# Altium project MB1312.PrjPCB
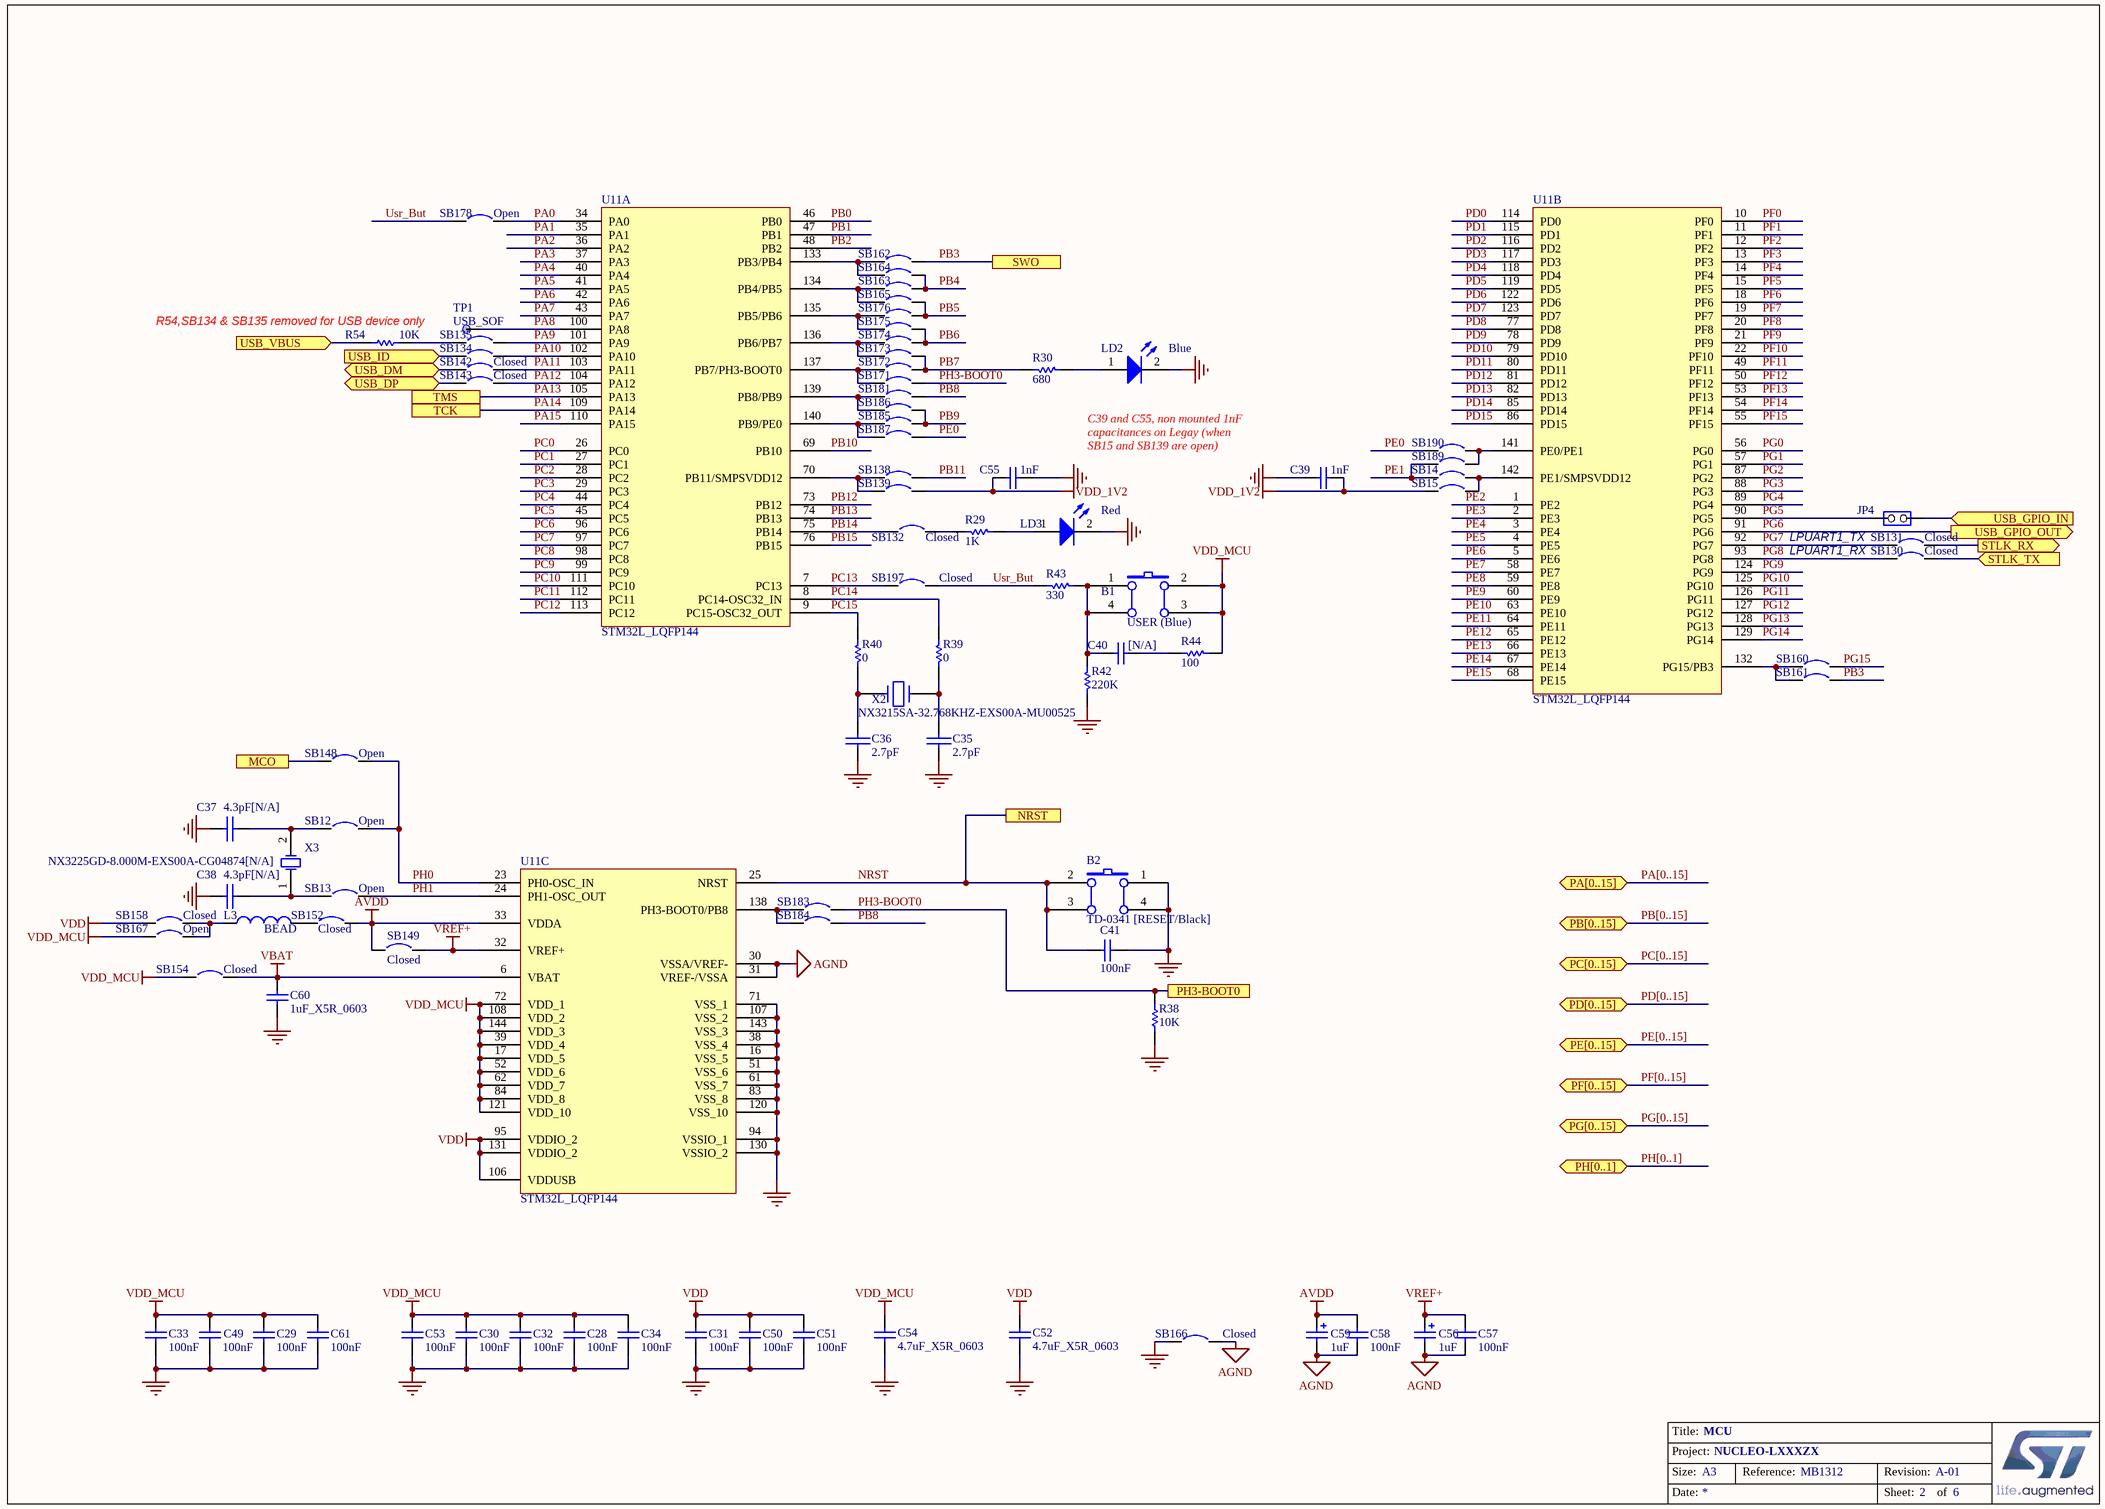
[diagram p0: STM32L_144.SchDoc]
2 sheets, 137 parts. Net scope: flat (ports and power ports of the same name join across sheets).
Board file: MB1312.PcbDoc
Sheets:
  STM32L_144.SchDoc
  Connectors.SchDoc

## Sheet STM32L_144.SchDoc: MCU
size A3; DocumentNumber: MB1312; Revision: A-01; SheetNumber: 2; SheetTotal: 6; Project: NUCLEO-LXXXZX

### Parts
B1  USER (Blue)  [PB-6X6mm-Blue]
B2  TD-0341 [RESET/Black]  [PB-6X6mm-Black]
C28  100nF  [0603C]
C29  100nF  [0603C]
C30  100nF  [0603C]
C31  100nF  [0603C]
C32  100nF  [0603C]
C33  100nF  [0603C]
C34  100nF  [0603C]
C35  2.7pF  [0603C]
C36  2.7pF  [0603C]
C37  4.3pF[N/A]  [0603C]
C38  4.3pF[N/A]  [0603C]
C39  1nF  [0603C]
C40  [N/A]  [0603C]
C41  100nF  [0603C]
C49  100nF  [0603C]
C50  100nF  [0603C]
C51  100nF  [0603C]
C52  4.7uF_X5R_0603  [0603C]
C53  100nF  [0603C]
C54  4.7uF_X5R_0603  [0603C]
C55  1nF  [0603C]
C56  value 1uF  [TAN-A]  (hidden comment: TAJA105K016R)
C57  100nF  [0603C]
C58  100nF  [0603C]
C59  value 1uF  [TAN-A]  (hidden comment: TAJA105K016R)
C60  1uF_X5R_0603  [0603C]
C61  100nF  [0603C]
JP4  (no value)  [HDR_1x2_2R54_V_M_S]
L3  BEAD  [0603L]
LD2  Blue  [0603D-B]
LD3  Red  [0603D-R]
R29  1K  [0603R]
R30  680  [0603R]
R38  10K  [0603R]
R39  0  [0603R]
R40  0  [0603R]
R42  220K  [0603R]
R43  330  [0603R]
R44  100  [0603R]
R54  10K  [0603R]
SB12  Open  [SB_0603]
SB13  Open  [SB_0603]
SB14  Circuit Breaker  [SB_0603]  (value not drawn)
SB15  Circuit Breaker  [SB_0603]  (value not drawn)
SB130  Closed  [SB_0603]
SB131  Closed  [SB_0603]
SB132  Closed  [SB_0603]
SB134  Circuit Breaker  [SB_0603]  (value not drawn)
SB135  Circuit Breaker  [SB_0603]  (value not drawn)
SB138  Circuit Breaker  [SB_0603]  (value not drawn)
SB139  Circuit Breaker  [SB_0603]  (value not drawn)
SB142  Closed  [SB_0603]
SB143  Closed  [SB_0603]
SB148  Open  [SB_0603]
SB149  Closed  [SB_0603]
SB152  Closed  [SB_0603]
SB154  Closed  [SB_0603]
SB158  Closed  [SB_0603]
SB160  Circuit Breaker  [SB_0603]  (value not drawn)
SB161  Circuit Breaker  [SB_0603]  (value not drawn)
SB162  Circuit Breaker  [SB_0603]  (value not drawn)
SB163  Circuit Breaker  [SB_0603]  (value not drawn)
SB164  Circuit Breaker  [SB_0603]  (value not drawn)
SB165  Circuit Breaker  [SB_0603]  (value not drawn)
SB166  Closed  [SB_0603]
SB167  Open  [SB_0603]
SB171  Circuit Breaker  [SB_0603]  (value not drawn)
SB172  Circuit Breaker  [SB_0603]  (value not drawn)
SB173  Circuit Breaker  [SB_0603]  (value not drawn)
SB174  Circuit Breaker  [SB_0603]  (value not drawn)
SB175  Circuit Breaker  [SB_0603]  (value not drawn)
SB176  Circuit Breaker  [SB_0603]  (value not drawn)
SB178  Open  [SB_0603]
SB181  Circuit Breaker  [SB_0603]  (value not drawn)
SB183  Circuit Breaker  [SB_0603]  (value not drawn)
SB184  Circuit Breaker  [SB_0603]  (value not drawn)
SB185  Circuit Breaker  [SB_0603]  (value not drawn)
SB186  Circuit Breaker  [SB_0603]  (value not drawn)
SB187  Circuit Breaker  [SB_0603]  (value not drawn)
SB189  Circuit Breaker  [SB_0603]  (value not drawn)
SB190  Circuit Breaker  [SB_0603]  (value not drawn)
SB197  Closed  [SB_0603]
TP1  USB_SOF  [TP]
U11  STM32L_LQFP144  [LQFP144_0R5_SKT]  (parts A,B,C of 3)
X2  NX3215SA-32.768KHZ-EXS00A-MU00525  [XTAL_2SM_3R2X1R5]
X3  NX3225GD-8.000M-EXS00A-CG04874[N/A]  [OSC_2SM_3R2x2R5]

### Ports
MCO, NRST, PA[0..15] (bidir), PB[0..15] (bidir), PC[0..15] (bidir), PD[0..15] (bidir), PE[0..15] (bidir), PF[0..15] (bidir), PG[0..15] (bidir), PH3-BOOT0, PH[0..1] (bidir), STLK_RX (out), STLK_TX (in), SWO, TCK, TMS, USB_DM (bidir), USB_DP (bidir), USB_GPIO_IN (in), USB_GPIO_OUT (out), USB_ID (in), USB_VBUS (in)

### Nets
AGND: C56.2 C57.2 C58.2 C59.2 SB166.2 U11.30(VSSA/VREF-) U11.31(VREF-/VSSA)
AVDD: C58.1 C59.1 SB149.1 SB152.2 U11.33(VDDA)
GND: B2.1(A0) B2.4(A1) C28.2 C29.2 C30.2 C31.2 C32.2 C33.2 C34.2 C35.2 C36.2 C37.2 C38.2 C39.1 C41.1 C49.2 C50.2 C51.2 C52.2 C53.2 C54.2 C55.1 C60.2 C61.2 LD2.2(K) LD3.2(K) R38.2 R42.2 SB166.1 U11.16(VSS_5) U11.38(VSS_4) U11.51(VSS_6) U11.61(VSS_7) U11.71(VSS_1) U11.83(VSS_8) U11.94(VSSIO_1) U11.107(VSS_2) U11.120(VSS_10) U11.130(VSSIO_2) U11.143(VSS_3)
VBAT: C60.1 SB154.2 U11.6(VBAT)
VDD: C31.1 C50.1 C51.1 C52.1 SB158.1 U11.95(VDDIO_2) U11.106(VDDUSB) U11.131(VDDIO_2)
VDD_1V2: C39.2 C55.2 SB15.2 SB139.2
VDD_MCU: B1.2(B0) B1.3(B1) C28.1 C29.1 C30.1 C32.1 C33.1 C34.1 C49.1 C53.1 C54.1 C61.1 R44.1 SB154.1 SB167.1 U11.17(VDD_5) U11.39(VDD_4) U11.52(VDD_6) U11.62(VDD_7) U11.72(VDD_1) U11.84(VDD_8) U11.108(VDD_2) U11.121(VDD_10) U11.144(VDD_3)
VREF+: C56.1 C57.1 SB149.2 U11.32(VREF+)
NRST: B2.2(B0) B2.3(B1) C41.2 U11.25(NRST) ; port NRST
PA0: SB178.2 U11.34(PA0)
PA1: U11.35(PA1)
PA2: U11.36(PA2)
PA3: U11.37(PA3)
PA4: U11.40(PA4)
PA5: U11.41(PA5)
PA6: U11.42(PA6)
PA7: U11.43(PA7)
PA8: TP1.1 U11.100(PA8)
PA9: SB135.2 U11.101(PA9)
PA10: SB134.2 U11.102(PA10)
PA11: SB142.2 U11.103(PA11)
PA12: SB143.2 U11.104(PA12)
PA13: U11.105(PA13) ; port TMS
PA14: U11.109(PA14) ; port TCK
PA15: U11.110(PA15)
PB0: U11.46(PB0)
PB1: U11.47(PB1)
PB2: U11.48(PB2)
PB3: SB161.2 SB162.2 ; port SWO
PB4: SB163.2 SB164.2
PB5: SB165.2 SB176.2
PB6: SB174.2 SB175.2
PB7: R30.1 SB172.2 SB173.2
PB8: SB181.2 SB184.2
PB9: SB185.2 SB186.2
PB10: U11.69(PB10)
PB11: SB138.2
PB12: U11.73(PB12)
PB13: U11.74(PB13)
PB14: SB132.1 U11.75(PB14)
PB15: U11.76(PB15)
PC0: U11.26(PC0)
PC1: U11.27(PC1)
PC2: U11.28(PC2)
PC3: U11.29(PC3)
PC4: U11.44(PC4)
PC5: U11.45(PC5)
PC6: U11.96(PC6)
PC7: U11.97(PC7)
PC8: U11.98(PC8)
PC9: U11.99(PC9)
PC10: U11.111(PC10)
PC11: U11.112(PC11)
PC12: U11.113(PC12)
PC13: SB197.1 U11.7(PC13)
PC14: R39.2 U11.8(PC14-OSC32_IN)
PC15: R40.2 U11.9(PC15-OSC32_OUT)
PD0: U11.114(PD0)
PD1: U11.115(PD1)
PD2: U11.116(PD2)
PD3: U11.117(PD3)
PD4: U11.118(PD4)
PD5: U11.119(PD5)
PD6: U11.122(PD6)
PD7: U11.123(PD7)
PD8: U11.77(PD8)
PD9: U11.78(PD9)
PD10: U11.79(PD10)
PD11: U11.80(PD11)
PD12: U11.81(PD12)
PD13: U11.82(PD13)
PD14: U11.85(PD14)
PD15: U11.86(PD15)
PE0: SB187.2 SB190.1
PE1: SB14.1 SB189.1
PE2: U11.1(PE2)
PE3: U11.2(PE3)
PE4: U11.3(PE4)
PE5: U11.4(PE5)
PE6: U11.5(PE6)
PE7: U11.58(PE7)
PE8: U11.59(PE8)
PE9: U11.60(PE9)
PE10: U11.63(PE10)
PE11: U11.64(PE11)
PE12: U11.65(PE12)
PE13: U11.66(PE13)
PE14: U11.67(PE14)
PE15: U11.68(PE15)
PF0: U11.10(PF0)
PF1: U11.11(PF1)
PF2: U11.12(PF2)
PF3: U11.13(PF3)
PF4: U11.14(PF4)
PF5: U11.15(PF5)
PF6: U11.18(PF6)
PF7: U11.19(PF7)
PF8: U11.20(PF8)
PF9: U11.21(PF9)
PF10: U11.22(PF10)
PF11: U11.49(PF11)
PF12: U11.50(PF12)
PF13: U11.53(PF13)
PF14: U11.54(PF14)
PF15: U11.55(PF15)
PG0: U11.56(PG0)
PG1: U11.57(PG1)
PG2: U11.87(PG2)
PG3: U11.88(PG3)
PG4: U11.89(PG4)
PG5: JP4.2(NO) U11.90(PG5)
PG6: U11.91(PG6) ; port USB_GPIO_OUT
PG7: SB131.1 U11.92(PG7)
PG8: SB130.1 U11.93(PG8)
PG9: U11.124(PG9)
PG10: U11.125(PG10)
PG11: U11.126(PG11)
PG12: U11.127(PG12)
PG13: U11.128(PG13)
PG14: U11.129(PG14)
PG15: SB160.2
PH0: SB12.2 SB148.1 U11.23(PH0-OSC_IN)
PH1: SB13.2 U11.24(PH1-OSC_OUT)
PH3-BOOT0: R38.1 SB171.2 SB183.2 ; port PH3-BOOT0
Usr_But: R43.2 SB178.1 SB197.2
NetB1_1: B1.1(A0) B1.4(A1) C40.2 R42.1 R43.1
NetC35_1: C35.1 R39.1 X2.2
NetC36_1: C36.1 R40.1 X2.1
NetC37_1: C37.1 SB12.1 X3.2(OSC2)
NetC38_1: C38.1 SB13.1 X3.1(OSC1)
NetC40_1: C40.1 R44.2
NetJP4_1: JP4.1(COMMON) ; port USB_GPIO_IN
NetL3_1: L3.1 SB158.2 SB167.2
NetL3_2: L3.2 SB152.1
NetLD2_1: LD2.1(A) R30.2
NetLD3_1: LD3.1(A) R29.2
NetR29_1: R29.1 SB132.2
NetR54_1: R54.1 ; port USB_VBUS
NetR54_2: R54.2 SB135.1
NetSB14_2: SB14.2 SB15.1 U11.142(PE1/SMPSVDD12)
NetSB130_2: SB130.2 ; port STLK_TX
NetSB131_2: SB131.2 ; port STLK_RX
NetSB134_1: SB134.1 ; port USB_ID
NetSB138_1: SB138.1 SB139.1 U11.70(PB11/SMPSVDD12)
NetSB142_1: SB142.1 ; port USB_DM
NetSB143_1: SB143.1 ; port USB_DP
NetSB148_2: SB148.2 ; port MCO
NetSB160_1: SB160.1 SB161.1 U11.132(PG15/PB3)
NetSB162_1: SB162.1 SB164.1 U11.133(PB3/PB4)
NetSB163_1: SB163.1 SB165.1 U11.134(PB4/PB5)
NetSB171_1: SB171.1 SB172.1 U11.137(PB7/PH3-BOOT0)
NetSB173_1: SB173.1 SB174.1 U11.136(PB6/PB7)
NetSB175_1: SB175.1 SB176.1 U11.135(PB5/PB6)
NetSB181_1: SB181.1 SB186.1 U11.139(PB8/PB9)
NetSB183_1: SB183.1 SB184.1 U11.138(PH3-BOOT0/PB8)
NetSB185_1: SB185.1 SB187.1 U11.140(PB9/PE0)
NetSB189_2: SB189.2 SB190.2 U11.141(PE0/PE1)

### Buses and harness runs
bus PA[0..15] = port PA[0..15]
bus PB[0..15] = port PB[0..15]
bus PC[0..15] = port PC[0..15]
bus PD[0..15] = port PD[0..15]
bus PE[0..15] = port PE[0..15]
bus PF[0..15] = port PF[0..15]
bus PG[0..15] = port PG[0..15]
bus PH[0..1] = port PH[0..1]

### Notes on the sheet
- (near R54) R54,SB134 & SB135 removed for USB device only
- C39 and C55, non mounted 1nF capacitances on Legay (when SB15 and SB139 are open)
- LPUART1_TX
- LPUART1_RX
- Title:
- Project:
- Size:
- Date:
- A3
- Reference:
- Sheet:
- Revision:
- of

### Library data of the parts
B1 B2 = SW PUSHBUTTON: SE PUSHBUTTON
C28-C34 C39 C49-C51 C53 C55 C57 C58 C61 = Cap: Capacitor; Value: 10nF; Published: 8-Jun-2000; Revision: July-2002: Re-released for DXP Platform.; Publisher: Altium Limited
C35-C38 = CAP: Capacitor
C40 C41 = CAP: Capacitor; Value: 100pF; Published: 8-Jun-2000; Revision: July-2002: Re-released for DXP Platform.; Publisher: Altium Limited
C52 C54 = CAP SMD 0603  X5R 1µF 25V 10%: 0603  X5R 4.7uF; Value: 1µF; Rated voltage: 25V; Tolerance: 10%; Manufacturer: *; Manufacturer P/N: *; Order code Farnell: 1288202RL; Power: *; Technology: X5R; Temperature  Factor: *; Temperature Max: +125°C; Temperature Min: -55°C; STS Code: *
C56 C59 = Cap Pol1: Tan Capacitor,1uF,10%,16V,Tan-A,TAJA105K016R; Manuf_1: AVX; Ordered by: Subcon; ECCN_US/EU: NA; Published: 8-Jun-2000; Revision: July-2002: Re-released for DXP Platform.; Publisher: Altium Limited; Manuf_Part_1: TAJA105K016R
C60 = CAP SMD 0603  X5R 1µF 25V 10%: 0603  X5R 1µF; Rated voltage: 25V; Tolerance: 10%; Manufacturer: *; Manufacturer P/N: *; Order code Farnell: 1288202RL; Value: 1µF; Power: *; Technology: X5R; Temperature  Factor: *; Temperature Max: +125°C; Temperature Min: -55°C; STS Code: *
JP4 = JP2
L3 = Inductor: Value: 100uH; Published: 8-Jun-2000; Revision: July-2002: Re-released for DXP Platform.; Publisher: Altium Limited
LD2 LD3 = LED2: Typical RED, GREEN, YELLOW, AMBER GaAs LED; Published: 8-Jun-2000; Revision: July-2002: Re-released for DXP Platform.; Publisher: Altium Limited
R29 = Res1: Resistor; Published: 8-Jun-2000; Revision: July-2002: Re-released for DXP Platform.; Publisher: Altium Limited; Value: 1K
R30 R39 R40 R43 R44 = Res1: Resistor; Value: 1K; Published: 8-Jun-2000; Revision: July-2002: Re-released for DXP Platform.; Publisher: Altium Limited
R38 R42 = res1: Resistor; Value: 1K; Published: 8-Jun-2000; Revision: July-2002: Re-released for DXP Platform.; Publisher: Altium Limited
R54 = Resistor_ST: Resistor 0402 / 0603 / 0805; Value: 10K
SB12 SB13 SB148 SB167 SB178 = Circuit Breaker: Published: 24-Mar-1999; Revision: July-2002: Re-released for DXP Platform.; Publisher: Altium Limited
SB14 SB15 SB134 SB135 SB138 SB139 SB160-SB165 SB171-SB176 SB181 SB183-SB187 SB189 SB190 = Circuit Breaker: Solder: NO; Published: 24-Mar-1999; Revision: July-2002: Re-released for DXP Platform.; Publisher: Altium Limited
SB130-SB132 SB142 SB143 SB149 SB152 SB154 SB158 SB166 SB197 = Circuit Breaker_close: Circuit Breaker; Published: 24-Mar-1999; Revision: July-2002: Re-released for DXP Platform.; Publisher: Altium Limited
TP1 = TP
X2 = CRYSTAL_32K: Crystal
X3 = XTAL: Crystal Oscillator; Published: 8-Jun-2000; LatestRevisionDate: 17-Jul-2002; LatestRevisionNote: Re-released for DXP Platform.; PackageReference: R38; Publisher: Altium Limited

## Sheet Connectors.SchDoc: Extension connectors
size A3; DocumentNumber: MB1312; Revision: A-01; SheetNumber: 5; SheetTotal: 6; Project: NUCLEO-LXXXZX
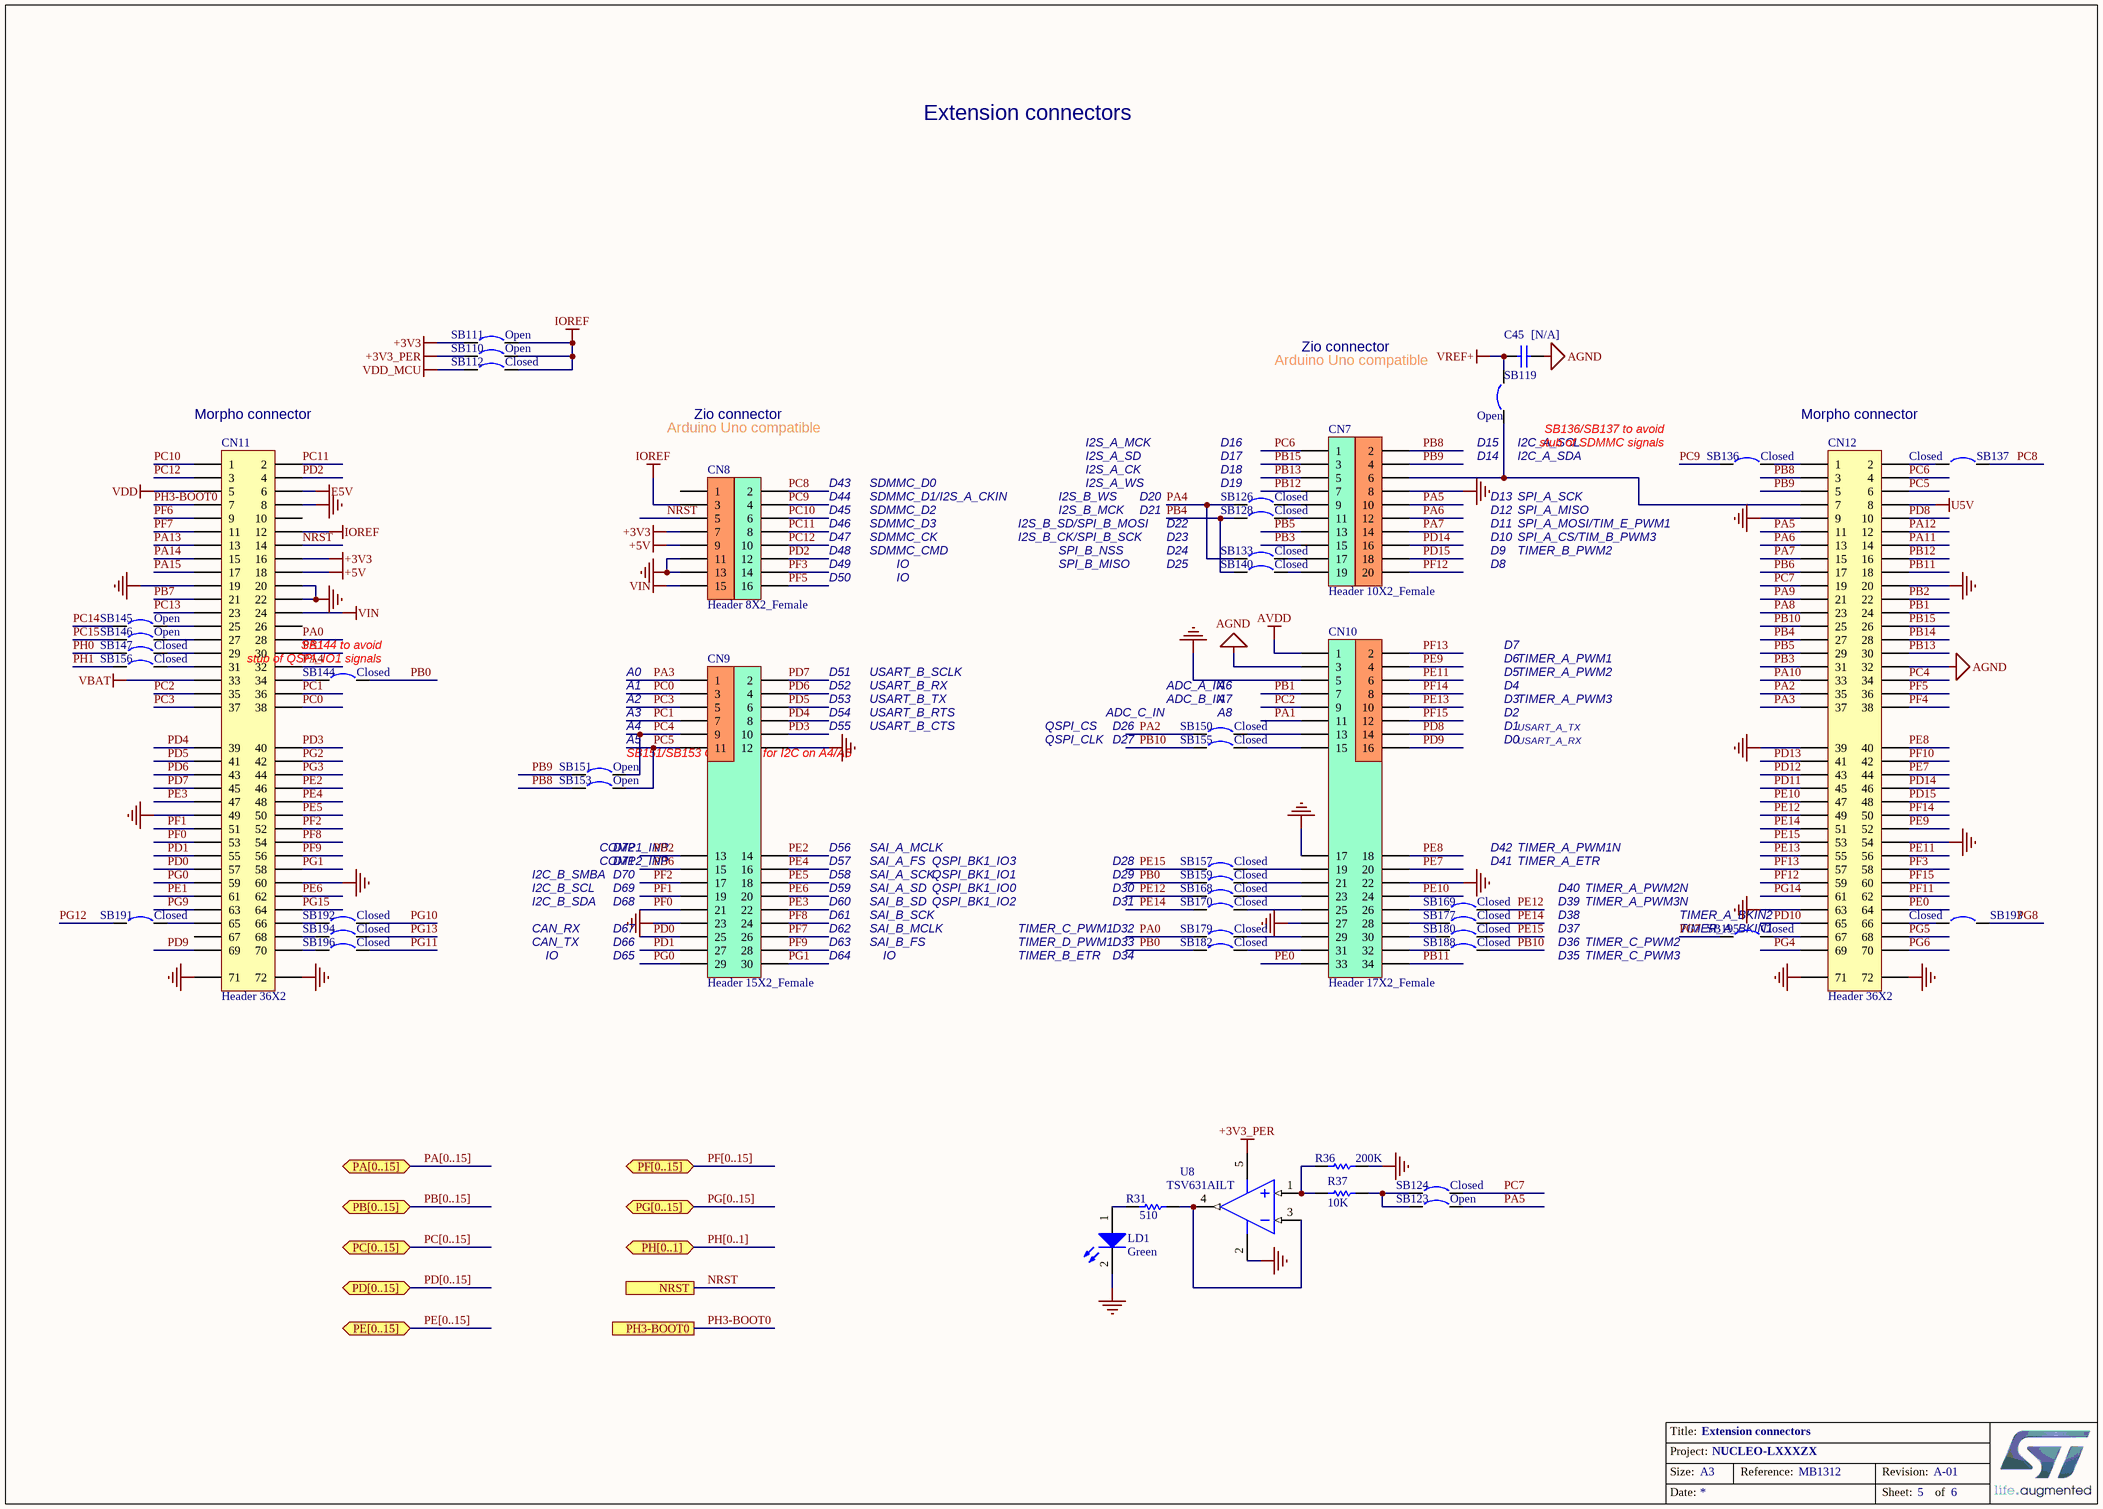
[diagram p1: Connectors.SchDoc]

### Parts
C45  [N/A]  [0603C]
CN7  Header 10X2_Female  [HDR_10x2_2R54_V_F]
CN8  Header 8X2_Female  [HDR_8x2_2R54_V_F]
CN9  Header 15X2_Female  [HDR_15x2_2R54_V_F]
CN10  Header 17X2_Female  [HDR_17x2_2R54_V_F]
CN11  Header 36X2  [HDR_2x36_2R54_V_M]
CN12  Header 36X2  [HDR_2x36_2R54_V_M]
LD1  Green  [0603D-G]
R31  510  [0603R]
R36  200K  [0603R]
R37  10K  [0603R]
SB110  Open  [SB_0603]
SB111  Open  [SB_0603]
SB112  Closed  [SB_0603]
SB119  Open  [SB_0603]
SB123  Open  [SB_0603]
SB124  Closed  [SB_0603]
SB126  Closed  [SB_0603]
SB128  Closed  [SB_0603]
SB133  Closed  [SB_0603]
SB136  Closed  [SB_0603]
SB137  Closed  [SB_0603]
SB140  Closed  [SB_0603]
SB144  Closed  [SB_0603]
SB145  Open  [SB_0603]
SB146  Open  [SB_0603]
SB147  Closed  [SB_0603]
SB150  Closed  [SB_0603]
SB151  Open  [SB_0603]
SB153  Open  [SB_0603]
SB155  Closed  [SB_0603]
SB156  Closed  [SB_0603]
SB157  Closed  [SB_0603]
SB159  Closed  [SB_0603]
SB168  Closed  [SB_0603]
SB169  Closed  [SB_0603]
SB170  Closed  [SB_0603]
SB177  Closed  [SB_0603]
SB179  Closed  [SB_0603]
SB180  Closed  [SB_0603]
SB182  Closed  [SB_0603]
SB188  Closed  [SB_0603]
SB191  Closed  [SB_0603]
SB192  Closed  [SB_0603]
SB193  Closed  [SB_0603]
SB194  Closed  [SB_0603]
SB195  Closed  [SB_0603]
SB196  Closed  [SB_0603]
U8  TSV631AILT  [SOT-23-5L]

### Ports
NRST, PA[0..15] (bidir), PB[0..15] (bidir), PC[0..15] (bidir), PD[0..15] (bidir), PE[0..15] (bidir), PF[0..15] (bidir), PG[0..15] (bidir), PH3-BOOT0, PH[0..1] (bidir)

### Nets
+3V3: CN8.7 CN11.16 SB111.1
+3V3_PER: SB110.1 U8.5(VCC)
+5V: CN8.9 CN11.18
AGND: C45.2 CN10.3 CN12.32
AVDD: CN10.1
E5V: CN11.6
GND: CN7.8 CN8.11 CN8.13 CN9.12 CN9.23 CN10.5 CN10.17 CN10.22 CN10.27 CN11.8 CN11.19 CN11.20 CN11.22 CN11.49 CN11.60 CN11.71 CN11.72 CN12.9 CN12.20 CN12.39 CN12.54 CN12.63 CN12.71 CN12.72 LD1.2(K) R36.2 U8.2(VDD)
IOREF: CN8.3 CN11.12 SB110.2 SB111.2 SB112.2
U5V: CN12.8
VBAT: CN11.33
VDD: CN11.5
VDD_MCU: SB112.1
VIN: CN8.15 CN11.24
VREF+: C45.1 SB119.1
NRST: CN8.5 CN11.14 ; port NRST
PA0: CN11.28 SB179.1
PA1: CN10.11 CN11.30
PA2: CN12.35 SB150.1
PA3: CN9.1 CN12.37
PA4: CN11.32 SB126.1 SB133.1
PA5: CN7.10 CN12.11 SB123.2
PA6: CN7.12 CN12.13
PA7: CN7.14 CN12.15
PA8: CN12.23
PA9: CN12.21
PA10: CN12.33
PA11: CN12.14
PA12: CN12.12
PA13: CN11.13
PA14: CN11.15
PA15: CN11.17
PB0: SB144.2 SB159.1 SB182.1
PB1: CN10.7 CN12.24
PB2: CN9.13 CN12.22
PB3: CN7.15 CN12.31
PB4: CN12.27 SB128.1 SB140.1
PB5: CN7.13 CN12.29
PB6: CN9.15 CN12.17
PB7: CN11.21
PB8: CN7.2 CN12.3 SB153.2
PB9: CN7.4 CN12.5 SB151.2
PB10: CN12.25 SB155.1 SB188.2
PB11: CN10.34 CN12.18
PB12: CN7.7 CN12.16
PB13: CN7.5 CN12.30
PB14: CN12.28
PB15: CN7.3 CN12.26
PC0: CN9.3 CN11.38
PC1: CN9.7 CN11.36
PC2: CN10.9 CN11.35
PC3: CN9.5 CN11.37
PC4: CN9.9 CN12.34 SB151.1
PC5: CN9.11 CN12.6 SB153.1
PC6: CN7.1 CN12.4
PC7: CN12.19 SB124.1
PC8: CN8.2 SB137.1
PC9: CN8.4 SB136.1
PC10: CN8.6 CN11.1
PC11: CN8.8 CN11.2
PC12: CN8.10 CN11.3
PC13: CN11.23
PC14: SB145.1
PC15: SB146.1
PD0: CN9.25 CN11.57
PD1: CN9.27 CN11.55
PD2: CN8.12 CN11.4
PD3: CN9.10 CN11.40
PD4: CN9.8 CN11.39
PD5: CN9.6 CN11.41
PD6: CN9.4 CN11.43
PD7: CN9.2 CN11.45
PD8: CN10.14 CN12.10
PD9: CN10.16 CN11.69
PD10: CN12.65
PD11: CN12.45
PD12: CN12.43
PD13: CN12.41
PD14: CN7.16 CN12.46
PD15: CN7.18 CN12.48
PE0: CN10.33 CN12.64
PE1: CN11.61
PE2: CN9.14 CN11.46
PE3: CN9.22 CN11.47
PE4: CN9.16 CN11.48
PE5: CN9.18 CN11.50
PE6: CN9.20 CN11.62
PE7: CN10.20 CN12.44
PE8: CN10.18 CN12.40
PE9: CN10.4 CN12.52
PE10: CN10.24 CN12.47
PE11: CN10.6 CN12.56
PE12: CN12.49 SB168.1 SB169.2
PE13: CN10.10 CN12.55
PE14: CN12.51 SB170.1 SB177.2
PE15: CN12.53 SB157.1 SB180.2
PF0: CN9.21 CN11.53
PF1: CN9.19 CN11.51
PF2: CN9.17 CN11.52
PF3: CN8.14 CN12.58
PF4: CN12.38
PF5: CN8.16 CN12.36
PF6: CN11.9
PF7: CN9.26 CN11.11
PF8: CN9.24 CN11.54
PF9: CN9.28 CN11.56
PF10: CN12.42
PF11: CN12.62
PF12: CN7.20 CN12.59
PF13: CN10.2 CN12.57
PF14: CN10.8 CN12.50
PF15: CN10.12 CN12.60
PG0: CN9.29 CN11.59
PG1: CN9.30 CN11.58
PG2: CN11.42
PG3: CN11.44
PG4: CN12.69
PG5: CN12.68
PG6: CN12.70
PG7: SB195.1
PG8: SB193.2
PG9: CN11.63
PG10: SB192.2
PG11: SB196.2
PG12: SB191.1
PG13: SB194.2
PG14: CN12.61
PG15: CN11.64
PH0: SB147.1
PH1: SB156.1
PH3-BOOT0: CN11.7 ; port PH3-BOOT0
NetCN7_6: CN7.6 CN12.7 SB119.2
NetCN7_9: CN7.9 SB126.2
NetCN7_11: CN7.11 SB128.2
NetCN7_17: CN7.17 SB133.2
NetCN7_19: CN7.19 SB140.2
NetCN10_13: CN10.13 SB150.2
NetCN10_15: CN10.15 SB155.2
NetCN10_19: CN10.19 SB157.2
NetCN10_21: CN10.21 SB159.2
NetCN10_23: CN10.23 SB168.2
NetCN10_25: CN10.25 SB170.2
NetCN10_26: CN10.26 SB169.1
NetCN10_28: CN10.28 SB177.1
NetCN10_29: CN10.29 SB179.2
NetCN10_30: CN10.30 SB180.1
NetCN10_31: CN10.31 SB182.2
NetCN10_32: CN10.32 SB188.1
NetCN11_25: CN11.25 SB145.2
NetCN11_27: CN11.27 SB146.2
NetCN11_29: CN11.29 SB147.2
NetCN11_31: CN11.31 SB156.2
NetCN11_34: CN11.34 SB144.1
NetCN11_65: CN11.65 SB191.2
NetCN11_66: CN11.66 SB192.1
NetCN11_68: CN11.68 SB194.1
NetCN11_70: CN11.70 SB196.1
NetCN12_1: CN12.1 SB136.2
NetCN12_2: CN12.2 SB137.2
NetCN12_66: CN12.66 SB193.1
NetCN12_67: CN12.67 SB195.2
NetLD1_1: LD1.1(A) R31.2
NetR31_1: R31.1 U8.3(IN-) U8.4(OUT)
NetR36_1: R36.1 R37.1 U8.1(IN+)
NetR37_2: R37.2 SB123.1 SB124.2

Not connected (* = marked no-connect by the designer): CN8 1; CN11 10 26 67

### Buses and harness runs
bus PA[0..15] = port PA[0..15]
bus PB[0..15] = port PB[0..15]
bus PC[0..15] = port PC[0..15]
bus PD[0..15] = port PD[0..15]
bus PE[0..15] = port PE[0..15]
bus PF[0..15] = port PF[0..15]
bus PG[0..15] = port PG[0..15]
bus PH[0..1] = port PH[0..1]

### Notes on the sheet
- Extension connectors
- Arduino Uno compatible
- Zio connector
- (near CN11) Morpho connector
- I2S_A_MCK
- D16
- (near SB119) D15
- (near SB119) I2C_A_SCL
- (near SB136) SB136/SB137 to avoid
- (near SB136) stub of SDMMC signals
- Morpho connector
- D43
- D44
- D45
- SDMMC_D0
- SDMMC_D1/I2S_A_CKIN
- SDMMC_D2
- I2S_B_WS
- I2S_B_MCK
- I2S_A_SD
- I2S_A_CK
- I2S_A_WS
- D20
- D21
- D17
- D18
- (near SB126) D19
- (near SB119) D14
- D13
- D12
- SPI_A_SCK
- SPI_A_MISO
- (near SB119) I2C_A_SDA
- D46
- D47
- D48
- D49
- D50
- SDMMC_CK
- SDMMC_CMD
- SDMMC_D3
- IO
- I2S_B_SD/SPI_B_MOSI
- I2S_B_CK/SPI_B_SCK
- SPI_B_MISO
- SPI_B_NSS
- D22
- D23
- D24
- D25
- D8
- D9
- D10
- D11
- TIMER_B_PWM2
- SPI_A_CS/TIM_B_PWM3
- SPI_A_MOSI/TIM_E_PWM1
- (near SB144) SB144 to avoid
- D7
- (near SB144) stub of QSPI_IO1 signals
- A0
- A1
- A2
- A3
- D51
- D52
- D53
- D54
- USART_B_TX
- USART_B_RX
- USART_B_SCLK
- USART_B_RTS
- ADC_A_IN
- ADC_B_IN
- (near SB150) ADC_C_IN
- A6
- A7
- (near SB150) A8
- D2
- D4
- D3
- D5
- D6
- TIMER_A_PWM1
- TIMER_A_PWM2
- TIMER_A_PWM3
- A4
- A5
- (near SB151) SB151/SB153 Close only for I2C on A4/A5
- D55
- USART_B_CTS
- QSPI_CLK
- QSPI_CS
- D26
- D27
- D0
- D1
- USART_A_TX
- USART_A_RX
- COMP1_INP
- D72
- D56
- SAI_A_MCLK
- D42
- TIMER_A_PWM1N
- I2C_B_SCL
- I2C_B_SDA
- I2C_B_SMBA
- COMP2_INP
- D71
- D70
- D69
- D68
- D57
- D58
- D59
- D60
- D61
- SAI_A_SD
- SAI_A_SCK
- SAI_A_FS
- SAI_B_SD
- SAI_B_SCK
- QSPI_BK1_IO0
- QSPI_BK1_IO2
- QSPI_BK1_IO1
- QSPI_BK1_IO3
- D28
- D29
- D30
- D31
- D41
- TIMER_A_ETR
- D38
- D39
- D40
- TIMER_A_PWM2N
- TIMER_A_PWM3N
- TIMER_A_BKIN2
- CAN_TX
- CAN_RX
- D67
- D66
- D65
- D62
- D63
- D64
- SAI_B_FS
- SAI_B_MCLK
- TIMER_D_PWM1
- TIMER_B_ETR
- TIMER_C_PWM1
- D32
- D33
- D34
- D35
- D36
- D37
- TIMER_C_PWM2
- TIMER_C_PWM3
- TIMER_A_BKIN1
- Title:
- Project:
- Size:
- Date:
- Reference:
- Sheet:
- Revision:
- of

### Library data of the parts
C45 = Cap: Capacitor,100nF,10%,16V,X7R,0603,YAGEO; Manuf_Part_1: CC0603KRX7R7BB104; Ordered by: Subcon; Published: 8-Jun-2000; Revision: July-2002: Re-released for DXP Platform.; Publisher: Altium Limited; Value: 100nF; Manuf_1: YAGEO
CN7 = Header 10X2_Female: Header, 10-Pin, Dual row,female; LatestRevisionDate: 17-Jul-2002; LatestRevisionNote: Re-released for DXP Platform.; Publisher: Altium Limited
CN8 = Header 8X2_Female: Header, 8-Pin, Dual row,female; LatestRevisionDate: 17-Jul-2002; LatestRevisionNote: Re-released for DXP Platform.; Publisher: Altium Limited
CN9 = Header 15X2_Female: Header, 15-Pin, Dual row,female; Revision: 17-Jul-2002: Re-released for DXP Platform.; Publisher: Altium Limited
CN10 = Header 17X2_Female: Header, 17-Pin, Dual row,female; Revision: 17-Jul-2002: Re-released for DXP Platform.; Publisher: Altium Limited
CN11 CN12 = Header 36X2: Header, 36-Pin, Dual row; System: Connector; Revision: 17-Jul-2002: Re-released for DXP Platform.; Publisher: Altium Limited
LD1 = LED2: as LD2 on sheet STM32L_144; Published: 8-Jun-2000; Revision: July-2002: Re-released for DXP Platform.; Publisher: Altium Limited
R31 = Res1: Resistor; Value: 1K; Published: 8-Jun-2000; Revision: July-2002: Re-released for DXP Platform.; Publisher: Altium Limited
R36 R37 = res1: Resistor; Value: 1K; Published: 8-Jun-2000; Revision: July-2002: Re-released for DXP Platform.; Publisher: Altium Limited
SB110 SB111 SB119 SB123 SB145 SB146 SB151 SB153 = Circuit Breaker: Published: 24-Mar-1999; Revision: July-2002: Re-released for DXP Platform.; Publisher: Altium Limited
SB112 SB124 SB126 SB128 SB133 SB136 SB137 SB140 SB144 SB147 SB150 SB155-SB157 SB159 SB168-SB170 SB177 SB179 SB180 SB182 SB188 SB191-SB196 = Circuit Breaker_close: Circuit Breaker; Published: 24-Mar-1999; Revision: July-2002: Re-released for DXP Platform.; Publisher: Altium Limited

## Nets that join several sheets
AGND: STM32L_144 (7 pins), Connectors (C45.2 CN10.3 CN12.32)
AVDD: STM32L_144 (5 pins), Connectors (CN10.1)
GND: STM32L_144 (40 pins), Connectors (27 pins)
VBAT: STM32L_144 (C60.1 SB154.2 U11.6), Connectors (CN11.33)
VDD: STM32L_144 (8 pins), Connectors (CN11.5)
VDD_MCU: STM32L_144 (24 pins), Connectors (SB112.1)
VREF+: STM32L_144 (C56.1 C57.1 SB149.2 U11.32), Connectors (C45.1 SB119.1)
NRST: STM32L_144 (B2.2 B2.3 C41.2 U11.25), Connectors (CN8.5 CN11.14)
PA0: STM32L_144 (SB178.2 U11.34), Connectors (CN11.28 SB179.1)
PA1: STM32L_144 (U11.35), Connectors (CN10.11 CN11.30)
PA2: STM32L_144 (U11.36), Connectors (CN12.35 SB150.1)
PA3: STM32L_144 (U11.37), Connectors (CN9.1 CN12.37)
PA4: STM32L_144 (U11.40), Connectors (CN11.32 SB126.1 SB133.1)
PA5: STM32L_144 (U11.41), Connectors (CN7.10 CN12.11 SB123.2)
PA6: STM32L_144 (U11.42), Connectors (CN7.12 CN12.13)
PA7: STM32L_144 (U11.43), Connectors (CN7.14 CN12.15)
PA8: STM32L_144 (TP1.1 U11.100), Connectors (CN12.23)
PA9: STM32L_144 (SB135.2 U11.101), Connectors (CN12.21)
PA10: STM32L_144 (SB134.2 U11.102), Connectors (CN12.33)
PA11: STM32L_144 (SB142.2 U11.103), Connectors (CN12.14)
PA12: STM32L_144 (SB143.2 U11.104), Connectors (CN12.12)
PA13: STM32L_144 (U11.105), Connectors (CN11.13)
PA14: STM32L_144 (U11.109), Connectors (CN11.15)
PA15: STM32L_144 (U11.110), Connectors (CN11.17)
PB0: STM32L_144 (U11.46), Connectors (SB144.2 SB159.1 SB182.1)
PB1: STM32L_144 (U11.47), Connectors (CN10.7 CN12.24)
PB2: STM32L_144 (U11.48), Connectors (CN9.13 CN12.22)
PB3: STM32L_144 (SB161.2 SB162.2), Connectors (CN7.15 CN12.31)
PB4: STM32L_144 (SB163.2 SB164.2), Connectors (CN12.27 SB128.1 SB140.1)
PB5: STM32L_144 (SB165.2 SB176.2), Connectors (CN7.13 CN12.29)
PB6: STM32L_144 (SB174.2 SB175.2), Connectors (CN9.15 CN12.17)
PB7: STM32L_144 (R30.1 SB172.2 SB173.2), Connectors (CN11.21)
PB8: STM32L_144 (SB181.2 SB184.2), Connectors (CN7.2 CN12.3 SB153.2)
PB9: STM32L_144 (SB185.2 SB186.2), Connectors (CN7.4 CN12.5 SB151.2)
PB10: STM32L_144 (U11.69), Connectors (CN12.25 SB155.1 SB188.2)
PB11: STM32L_144 (SB138.2), Connectors (CN10.34 CN12.18)
PB12: STM32L_144 (U11.73), Connectors (CN7.7 CN12.16)
PB13: STM32L_144 (U11.74), Connectors (CN7.5 CN12.30)
PB14: STM32L_144 (SB132.1 U11.75), Connectors (CN12.28)
PB15: STM32L_144 (U11.76), Connectors (CN7.3 CN12.26)
PC0: STM32L_144 (U11.26), Connectors (CN9.3 CN11.38)
PC1: STM32L_144 (U11.27), Connectors (CN9.7 CN11.36)
PC2: STM32L_144 (U11.28), Connectors (CN10.9 CN11.35)
PC3: STM32L_144 (U11.29), Connectors (CN9.5 CN11.37)
PC4: STM32L_144 (U11.44), Connectors (CN9.9 CN12.34 SB151.1)
PC5: STM32L_144 (U11.45), Connectors (CN9.11 CN12.6 SB153.1)
PC6: STM32L_144 (U11.96), Connectors (CN7.1 CN12.4)
PC7: STM32L_144 (U11.97), Connectors (CN12.19 SB124.1)
PC8: STM32L_144 (U11.98), Connectors (CN8.2 SB137.1)
PC9: STM32L_144 (U11.99), Connectors (CN8.4 SB136.1)
PC10: STM32L_144 (U11.111), Connectors (CN8.6 CN11.1)
PC11: STM32L_144 (U11.112), Connectors (CN8.8 CN11.2)
PC12: STM32L_144 (U11.113), Connectors (CN8.10 CN11.3)
PC13: STM32L_144 (SB197.1 U11.7), Connectors (CN11.23)
PC14: STM32L_144 (R39.2 U11.8), Connectors (SB145.1)
PC15: STM32L_144 (R40.2 U11.9), Connectors (SB146.1)
PD0: STM32L_144 (U11.114), Connectors (CN9.25 CN11.57)
PD1: STM32L_144 (U11.115), Connectors (CN9.27 CN11.55)
PD2: STM32L_144 (U11.116), Connectors (CN8.12 CN11.4)
PD3: STM32L_144 (U11.117), Connectors (CN9.10 CN11.40)
PD4: STM32L_144 (U11.118), Connectors (CN9.8 CN11.39)
PD5: STM32L_144 (U11.119), Connectors (CN9.6 CN11.41)
PD6: STM32L_144 (U11.122), Connectors (CN9.4 CN11.43)
PD7: STM32L_144 (U11.123), Connectors (CN9.2 CN11.45)
PD8: STM32L_144 (U11.77), Connectors (CN10.14 CN12.10)
PD9: STM32L_144 (U11.78), Connectors (CN10.16 CN11.69)
PD10: STM32L_144 (U11.79), Connectors (CN12.65)
PD11: STM32L_144 (U11.80), Connectors (CN12.45)
PD12: STM32L_144 (U11.81), Connectors (CN12.43)
PD13: STM32L_144 (U11.82), Connectors (CN12.41)
PD14: STM32L_144 (U11.85), Connectors (CN7.16 CN12.46)
PD15: STM32L_144 (U11.86), Connectors (CN7.18 CN12.48)
PE0: STM32L_144 (SB187.2 SB190.1), Connectors (CN10.33 CN12.64)
PE1: STM32L_144 (SB14.1 SB189.1), Connectors (CN11.61)
PE2: STM32L_144 (U11.1), Connectors (CN9.14 CN11.46)
PE3: STM32L_144 (U11.2), Connectors (CN9.22 CN11.47)
PE4: STM32L_144 (U11.3), Connectors (CN9.16 CN11.48)
PE5: STM32L_144 (U11.4), Connectors (CN9.18 CN11.50)
PE6: STM32L_144 (U11.5), Connectors (CN9.20 CN11.62)
PE7: STM32L_144 (U11.58), Connectors (CN10.20 CN12.44)
PE8: STM32L_144 (U11.59), Connectors (CN10.18 CN12.40)
PE9: STM32L_144 (U11.60), Connectors (CN10.4 CN12.52)
PE10: STM32L_144 (U11.63), Connectors (CN10.24 CN12.47)
PE11: STM32L_144 (U11.64), Connectors (CN10.6 CN12.56)
PE12: STM32L_144 (U11.65), Connectors (CN12.49 SB168.1 SB169.2)
PE13: STM32L_144 (U11.66), Connectors (CN10.10 CN12.55)
PE14: STM32L_144 (U11.67), Connectors (CN12.51 SB170.1 SB177.2)
PE15: STM32L_144 (U11.68), Connectors (CN12.53 SB157.1 SB180.2)
PF0: STM32L_144 (U11.10), Connectors (CN9.21 CN11.53)
PF1: STM32L_144 (U11.11), Connectors (CN9.19 CN11.51)
PF2: STM32L_144 (U11.12), Connectors (CN9.17 CN11.52)
PF3: STM32L_144 (U11.13), Connectors (CN8.14 CN12.58)
PF4: STM32L_144 (U11.14), Connectors (CN12.38)
PF5: STM32L_144 (U11.15), Connectors (CN8.16 CN12.36)
PF6: STM32L_144 (U11.18), Connectors (CN11.9)
PF7: STM32L_144 (U11.19), Connectors (CN9.26 CN11.11)
PF8: STM32L_144 (U11.20), Connectors (CN9.24 CN11.54)
PF9: STM32L_144 (U11.21), Connectors (CN9.28 CN11.56)
PF10: STM32L_144 (U11.22), Connectors (CN12.42)
PF11: STM32L_144 (U11.49), Connectors (CN12.62)
PF12: STM32L_144 (U11.50), Connectors (CN7.20 CN12.59)
PF13: STM32L_144 (U11.53), Connectors (CN10.2 CN12.57)
PF14: STM32L_144 (U11.54), Connectors (CN10.8 CN12.50)
PF15: STM32L_144 (U11.55), Connectors (CN10.12 CN12.60)
PG0: STM32L_144 (U11.56), Connectors (CN9.29 CN11.59)
PG1: STM32L_144 (U11.57), Connectors (CN9.30 CN11.58)
PG2: STM32L_144 (U11.87), Connectors (CN11.42)
PG3: STM32L_144 (U11.88), Connectors (CN11.44)
PG4: STM32L_144 (U11.89), Connectors (CN12.69)
PG5: STM32L_144 (JP4.2 U11.90), Connectors (CN12.68)
PG6: STM32L_144 (U11.91), Connectors (CN12.70)
PG7: STM32L_144 (SB131.1 U11.92), Connectors (SB195.1)
PG8: STM32L_144 (SB130.1 U11.93), Connectors (SB193.2)
PG9: STM32L_144 (U11.124), Connectors (CN11.63)
PG10: STM32L_144 (U11.125), Connectors (SB192.2)
PG11: STM32L_144 (U11.126), Connectors (SB196.2)
PG12: STM32L_144 (U11.127), Connectors (SB191.1)
PG13: STM32L_144 (U11.128), Connectors (SB194.2)
PG14: STM32L_144 (U11.129), Connectors (CN12.61)
PG15: STM32L_144 (SB160.2), Connectors (CN11.64)
PH0: STM32L_144 (SB12.2 SB148.1 U11.23), Connectors (SB147.1)
PH1: STM32L_144 (SB13.2 U11.24), Connectors (SB156.1)
PH3-BOOT0: STM32L_144 (R38.1 SB171.2 SB183.2), Connectors (CN11.7)